# EAGLE design Car display system PCB (EAGLE 9.4.0)
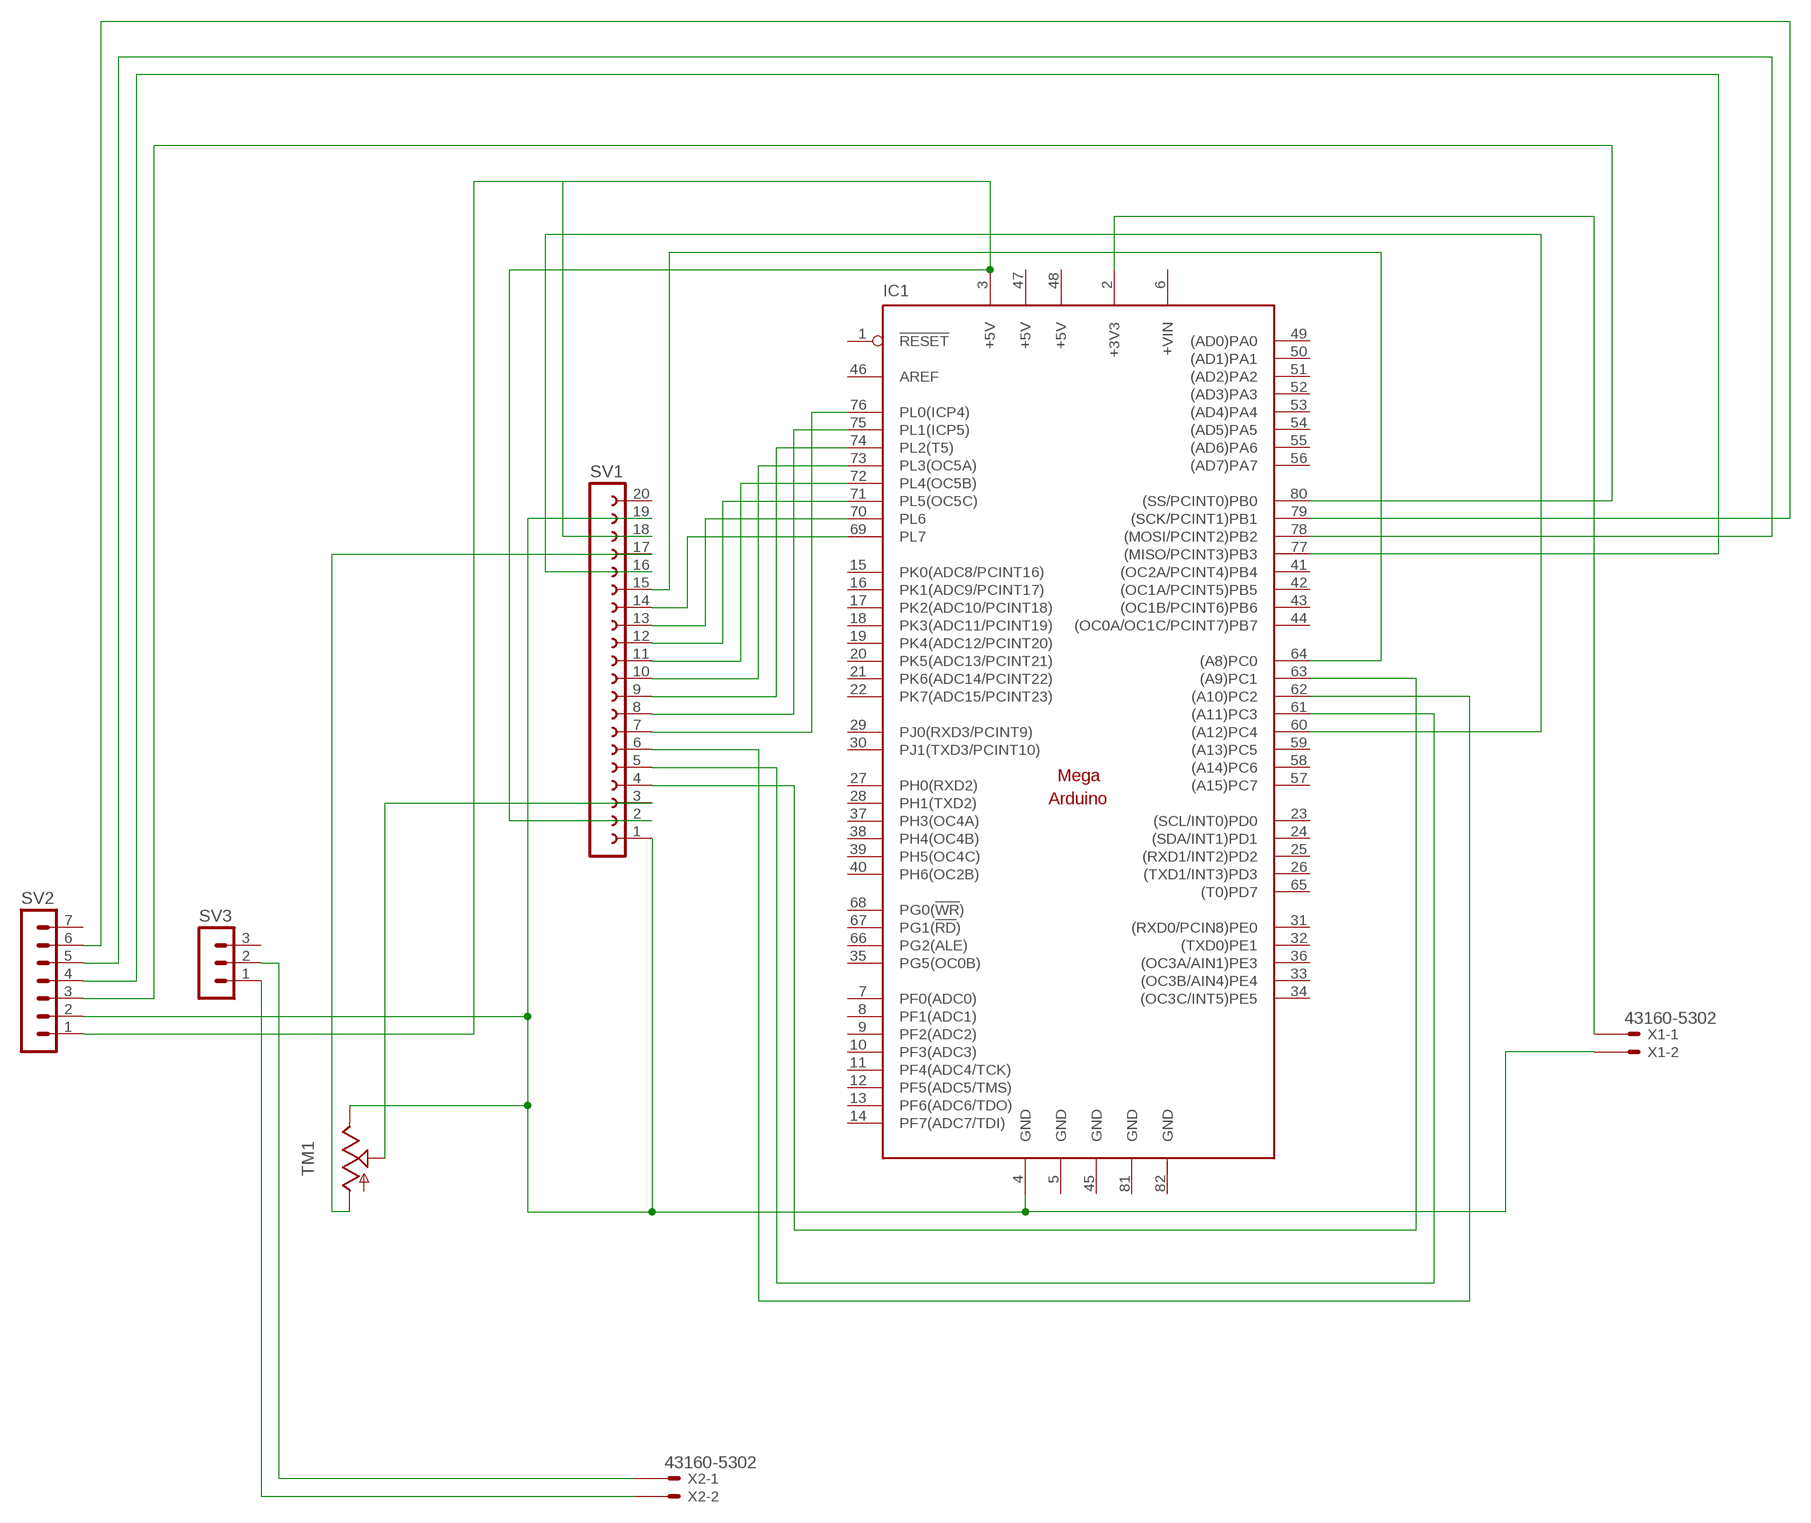
[diagram p0: schematic, sheet 1]

## Parts
IC1  MEGAARDUINO_1  [MEGA_ARDUINO]
SV1  FE20W  [FE20W]
SV2  MA07-1  [MA07-1]
SV3  MA03-1  [MA03-1]
TM1  TRIM  [6MM]
X1  43160-5302  [43160-XX02]
X2  43160-5302  [43160-XX02]

## Nets
N$1: SV1.17 TM1.A
N$2: IC1.63((A9)PC1) SV1.4
N$3: IC1.61((A11)PC3) SV1.5
N$4: IC1.62((A10)PC2) SV1.6
N$5: IC1.76(PL0(ICP4)) SV1.7
N$6: IC1.75(PL1(ICP5)) SV1.8
N$7: IC1.74(PL2(T5)) SV1.9
N$8: IC1.73(PL3(OC5A)) SV1.10
N$9: IC1.72(PL4(OC5B)) SV1.11
N$10: IC1.71(PL5(OC5C)) SV1.12
N$11: IC1.70(PL6) SV1.13
N$12: IC1.69(PL7) SV1.14
N$13: IC1.64((A8)PC0) SV1.15
N$14: IC1.60((A12)PC4) SV1.16
N$15: IC1.4(GND) SV1.1 SV1.19 SV2.2 TM1.E X1.2@1(-2:S)
N$16: IC1.3(+5V) SV1.2 SV1.18 SV2.1
N$17: IC1.80((SS/PCINT0)PB0) SV2.3
N$18: IC1.77((MISO/PCINT3)PB3) SV2.4
N$19: IC1.78((MOSI/PCINT2)PB2) SV2.5
N$20: IC1.79((SCK/PCINT1)PB1) SV2.6
N$21: SV1.3 TM1.S
N$22: SV3.1 X2.2@1(-2:S)
N$23: IC1.2(+3V3) X1.1@1(-1:S)
N$24: SV3.2 X2.1@1(-1:S)
Unconnected: IC1.1(!RESET) IC1.7(PF0(ADC0)) IC1.8(PF1(ADC1)) IC1.9(PF2(ADC2)) IC1.10(PF3(ADC3)) IC1.11(PF4(ADC4/TCK)) IC1.12(PF5(ADC5/TMS)) IC1.13(PF6(ADC6/TDO)) IC1.14(PF7(ADC7/TDI)) IC1.15(PK0(ADC8/PCINT16)) IC1.16(PK1(ADC9/PCINT17)) IC1.17(PK2(ADC10/PCINT18)) IC1.18(PK3(ADC11/PCINT19)) IC1.19(PK4(ADC12/PCINT20)) IC1.20(PK5(ADC13/PCINT21)) IC1.21(PK6(ADC14/PCINT22)) IC1.22(PK7(ADC15/PCINT23)) IC1.23((SCL/INT0)PD0) IC1.24((SDA/INT1)PD1) IC1.25((RXD1/INT2)PD2) IC1.26((TXD1/INT3)PD3) IC1.27(PH0(RXD2)) IC1.28(PH1(TXD2)) IC1.29(PJ0(RXD3/PCINT9)) IC1.30(PJ1(TXD3/PCINT10)) IC1.31((RXD0/PCIN8)PE0) IC1.32((TXD0)PE1) IC1.33((OC3B/AIN4)PE4) IC1.34((OC3C/INT5)PE5) IC1.35(PG5(OC0B)) IC1.36((OC3A/AIN1)PE3) IC1.37(PH3(OC4A)) IC1.38(PH4(OC4B)) IC1.39(PH5(OC4C)) IC1.40(PH6(OC2B)) IC1.41((OC2A/PCINT4)PB4) IC1.42((OC1A/PCINT5)PB5) IC1.43((OC1B/PCINT6)PB6) IC1.44((OC0A/OC1C/PCINT7)PB7) IC1.46(AREF) IC1.49((AD0)PA0) IC1.50((AD1)PA1) IC1.51((AD2)PA2) IC1.52((AD3)PA3) IC1.53((AD4)PA4) IC1.54((AD5)PA5) IC1.55((AD6)PA6) IC1.56((AD7)PA7) IC1.57((A15)PC7) IC1.58((A14)PC6) IC1.59((A13)PC5) IC1.65((T0)PD7) IC1.66(PG2(ALE)) IC1.67(PG1(!RD!)) IC1.68(PG0(!WR!)) SV1.20 SV2.7 SV3.3 X1.1@2(-1:S) X1.2@2(-2:S) X2.1@2(-1:S) X2.2@2(-2:S)

## Power pins joined to a net without a drawn wire
+5V: IC1.47(+5V) IC1.48(+5V)
+VIN: IC1.6(+VIN)
GND: IC1.5(GND) IC1.45(GND) IC1.81(GND) IC1.82(GND)

## Library data of the parts
IC1 = arduino:MEGAARDUINO_1: The Arduino Mega is a microcontroller board based on the ATmega1280. - 54 digital input/output pins (of which 14 can be used as PWM outputs) - 16 analog inputs - 4 UARTs (hardware serial ports) - 16 MHz crystal oscillator - USB connection - power jack - ICSP header - reset button It contains everything needed to support the microcontroller; simply connect it to a computer with a USB cable or power it with a AC-to-DC adapter or battery to get started. The Mega is compatible with most shields designed for the Arduino Duemilanove or Diecimila. http://arduino.cc/en/Main/ArduinoBoardMega
SV1 = con-lsta:FE20W: FEMALE HEADER; OC_FARNELL: unknown; OC_NEWARK: unknown
SV2 = con-lstb:MA07-1: PIN HEADER; OC_FARNELL: unknown; OC_NEWARK: unknown
SV3 = con-lstb:MA03-1: PIN HEADER; OC_FARNELL: unknown; OC_NEWARK: unknown
TM1 = adafruit:TRIM
X1 X2 = con-molex:43160-*02: SDA-43160 Connector Source: http://www.molex.com/pdm_docs/sd/431601306_sd.pdf; MF: MOLEX; MPN: 43160-5302; OC_FARNELL: unknown; OC_NEWARK: 92M1498

## Board
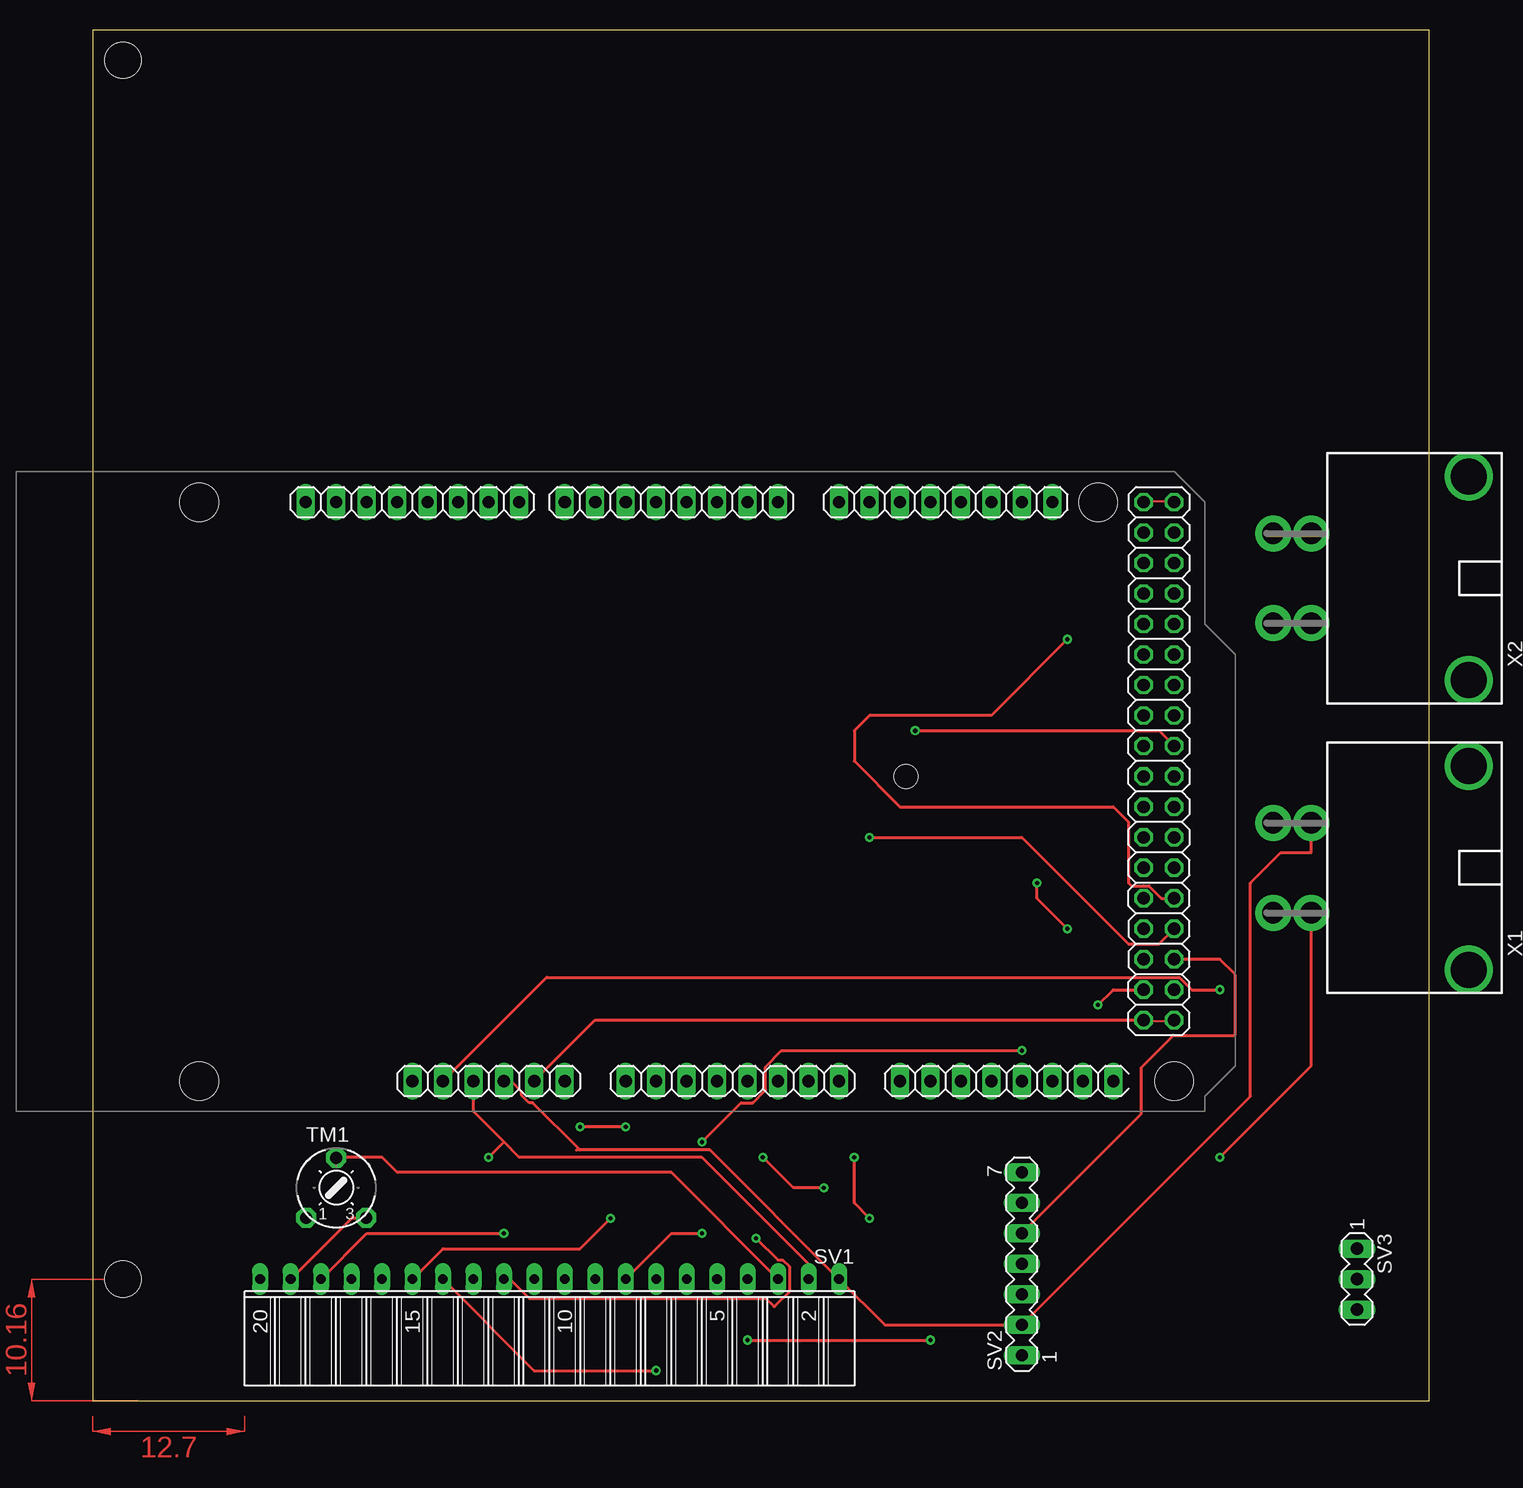
[diagram p1: board, top side]
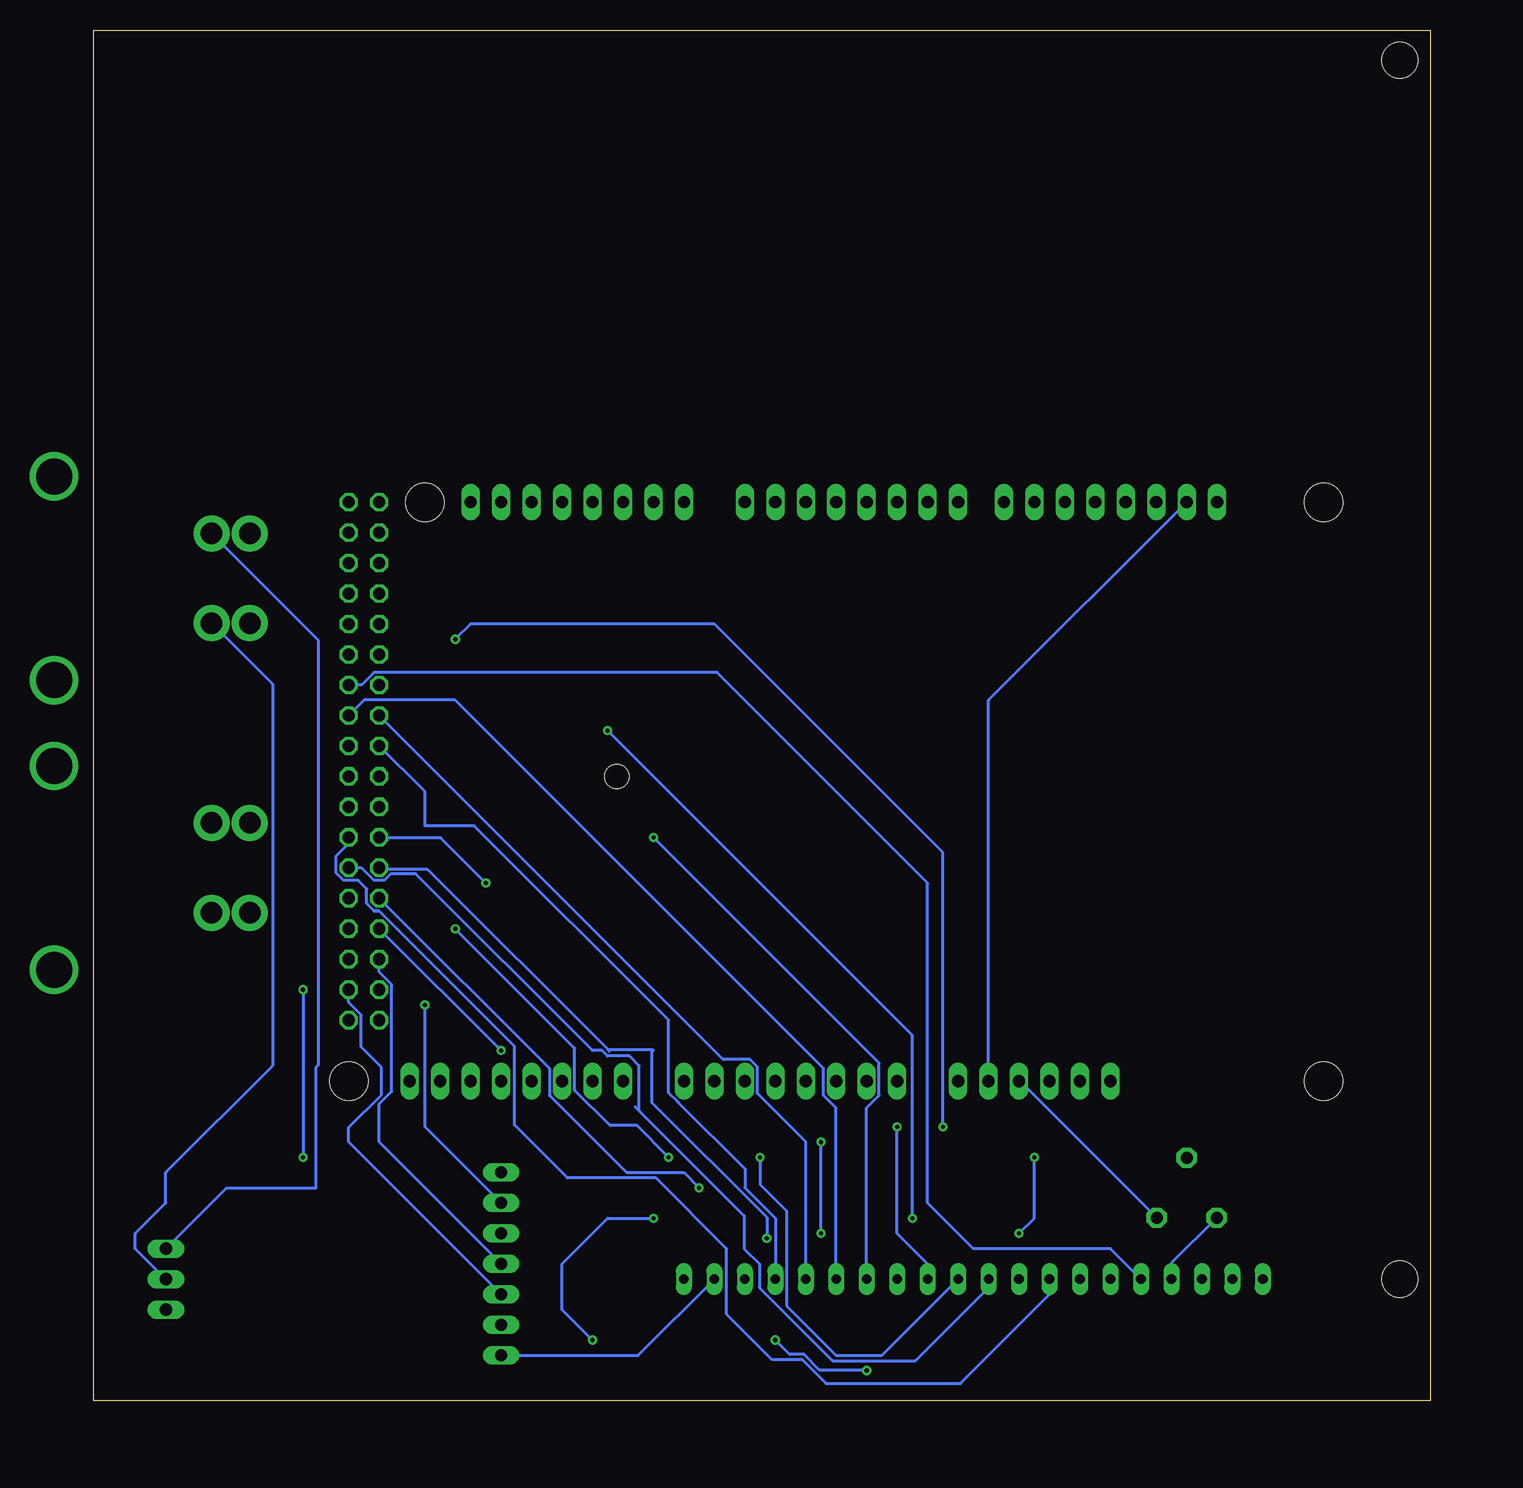
[diagram p2: board, bottom side, seen from below]

Size 111.43 x 114.29 mm. Coordinates in mm from the lower left corner, seen from the top.
Outline: 0,0 111.43,0 111.43,114.29 0,114.29 0,0
Copper layers (1*16): Top 0.035mm / dielectric 1.5mm / Bottom 0.035mm
Design rules "default": minimum track width 6mil, minimum drill 0.35mm, track to track 6mil, track to pad 6mil, pad to pad 6mil, via to via 6mil, smd to smd 6mil, copper to edge 40mil, drill to drill 6mil, minimum pad ring 10mil, minimum via ring 8mil, stop-mask expansion 4mil, vias tented up to drill 0mil, thermal gap 10mil
Holes 3 mm at 2.54,111.76 2.54,10.16

### Footprints (pad centres in the part's own frame; a part is rotated, then mirrored left to right if it is on the bottom)
MEGA_ARDUINO = drill 1.016 long: 1 33.02,2.54; 2 35.56,2.54; 3 38.1,2.54; 4 40.64,2.54; 5 43.18,2.54; 6 45.72,2.54; 7 50.8,2.54; 8 53.34,2.54; 9 55.88,2.54; 10 58.42,2.54; 11 60.96,2.54; 12 63.5,2.54; 13 66.04,2.54; 14 68.58,2.54; 15 73.66,2.54; 16 76.2,2.54; 17 78.74,2.54; 18 81.28,2.54; 19 83.82,2.54; 20 86.36,2.54; 21 88.9,2.54; 22 91.44,2.54; 23 86.36,50.8; 24 83.82,50.8; 25 81.28,50.8; 26 78.74,50.8; 27 76.2,50.8; 28 73.66,50.8; 29 71.12,50.8; 30 68.58,50.8; 31 63.5,50.8; 32 60.96,50.8; 33 58.42,50.8; 34 55.88,50.8; 35 53.34,50.8; 36 50.8,50.8; 37 48.26,50.8; 38 45.72,50.8; 39 41.91,50.8; 40 39.37,50.8; 41 36.83,50.8; 42 34.29,50.8; 43 31.75,50.8; 44 29.21,50.8; 45 26.67,50.8; 46 24.13,50.8 | drill 1.016 octagon: 47 93.98,50.8; 48 96.52,50.8; 49 93.98,48.26; 50 96.52,48.26; 51 93.98,45.72; 52 96.52,45.72; 53 93.98,43.18; 54 96.52,43.18; 55 93.98,40.64; 56 96.52,40.64; 57 93.98,38.1; 58 96.52,38.1; 59 93.98,35.56; 60 96.52,35.56; 61 93.98,33.02; 62 96.52,33.02; 63 93.98,30.48; 64 96.52,30.48; 65 93.98,27.94; 66 96.52,27.94; 67 93.98,25.4; 68 96.52,25.4; 69 93.98,22.86; 70 96.52,22.86; 71 93.98,20.32; 72 96.52,20.32; 73 93.98,17.78; 74 96.52,17.78; 75 93.98,15.24; 76 96.52,15.24; 77 93.98,12.7; 78 96.52,12.7; 79 93.98,10.16; 80 96.52,10.16; 81 93.98,7.62; 82 96.52,7.62 | hole 3.2: 15.24,50.8; 15.24,2.54; 90.17,50.8; 96.52,2.54 | hole 2: 74.168,27.94
FE20W = drill 0.813 long: 1 -24.13,0; 2 -21.59,0; 3 -19.05,0; 4 -16.51,0; 5 -13.97,0; 6 -11.43,0; 7 -8.89,0; 8 -6.35,0; 9 -3.81,0; 10 -1.27,0; 11 1.27,0; 12 3.81,0; 13 6.35,0; 14 8.89,0; 15 11.43,0; 16 13.97,0; 17 16.51,0; 18 19.05,0; 19 21.59,0; 20 24.13,0
MA07-1 = drill 1.016 long: 1 -7.62,0; 2 -5.08,0; 3 -2.54,0; 4 0,0; 5 2.54,0; 6 5.08,0; 7 7.62,0
MA03-1 = drill 1.016 long: 1 -2.54,0; 2 0,0; 3 2.54,0
6MM = drill 1 pad 1.676 octagon: A -2.5,-2.5; E 2.5,-2.5; S 0,2.5
43160-XX02 = drill 1.8 pad 3: 1@1 -3.745,0; 1@2 -3.745,3.18; 2@1 3.745,0; 2@2 3.745,3.18 | drill 3 pad 3.4: M1 -8.495,-13.13; M2 8.495,-13.13

### Placement (x,y rotation side)
IC1  -6.35,24.13 0 top
SV1  38.1,10.16 180 top
SV2  77.47,11.43 90 top
SV3  105.41,10.16 270 top
TM1  20.32,17.78 0 top
X1  101.6,44.45 90 top
X2  101.6,68.58 90 top

### Tracks (layer width: path | path; a pad name or v marks a point on that pad's centre or on a via)
+5V
  Top 0.152: IC1.47 87.63,74.98 90.07,74.98 IC1.48
GND
  Top 0.152: IC1.82 90.07,31.7 87.63,31.7 IC1.81
  Top 0.254: IC1.5 41.91,31.75 IC1.81
  Bottom 0.254: IC1.5 36.83,58.42 IC1.45
N$1
  Bottom 0.254: TM1.A 21.59,11.51 SV1.17
N$2
  Bottom 0.254: IC1.63 83.82,50.8 83.82,47.95 79.71,47.95 63.5,31.75 63.5,25.7 62.71,24.92 62.66,24.87 57.15,19.36 57.15,17.78 54.61,15.24 SV1.4
N$3
  Bottom 0.254: SV1.5 52.07,21.59 56.11,25.63 56.11,27.86 56.72,28.47 58.95,28.47 IC1.61
N$4
  Bottom 0.254: SV1.6 49.53,24.43 50.57,25.48 50.57,27.71 81.28,58.42 88.9,58.42 IC1.62
N$5  (via drill 0.35)
  Top 0.254: v64.77,46.99 77.47,46.99 86.36,38.1 88.9,38.1 IC1.76
  Bottom 0.254: SV1.7 46.99,24.43 45.95,25.48 45.95,28.17 v64.77,46.99
N$6  (via drill 0.35)
  Top 0.254: SV1.8 48.26,13.97 v50.8,13.97 | v50.8,21.59 54.08,24.87 55.04,24.87 56.11,25.93 56.11,27.86 57.45,29.21 v77.47,29.21
  Bottom 0.254: v50.8,13.97 v50.8,21.59 | v77.47,29.21 IC1.75
N$7  (via drill 0.35)
  Top 0.254: v44.45,22.86 v40.64,22.86 | v81.28,63.5 74.93,57.15 64.77,57.15 63.5,55.88 63.5,53.34 67.31,49.53 85.09,49.53 86.36,48.26 86.36,43.18 86.59,42.95 87.63,42.95 88.06,42.95 89.1,41.91 IC1.74
  Bottom 0.254: SV1.9 41.91,11.43 44.45,13.97 v44.45,22.86 | v40.64,22.86 40.64,45.72 59.69,64.77 80.01,64.77 v81.28,63.5
N$8  (via drill 0.35)
  Top 0.254: v60.96,17.78 58.42,17.78 v55.88,20.32
  Bottom 0.254: IC1.73 73.43,27.71 73.43,25.48 67,19.05 62.23,19.05 v60.96,17.78 | v55.88,20.32 55.88,18.05 53.67,15.84 53.67,7.95 49.53,3.81 45.72,3.81 SV1.10
N$9
  Bottom 0.254: SV1.11 36.83,9.45 42.93,3.35 49.84,3.35 55.93,9.45 55.93,11.43 57.2,12.7 57.2,15.44 65.96,24.21 | 66.29,24.54 65.96,24.21 | 65.96,24.21 65.96,27.94 66.78,28.75 68.6,28.75 69.05,29.21 69.85,29.21 84.58,43.94 86.66,43.94 87.2,43.41 88.06,43.41 89.1,44.45 IC1.72
N$10  (via drill 0.35)
  Top 0.152: 34.9,10.06 34.29,10.06 SV1.12
  Top 0.254: 34.9,10.06 36.42,8.53 56.13,8.53 56.79,7.87 56.85,7.87 58.09,9.11 58.09,11.21 57.54,11.76 57.12,11.76 v55.32,13.56
  Bottom 0.254: v55.32,13.56 55.32,15.29 64.87,24.84 64.87,29.11 64.77,29.21 64.82,29.26 68.53,29.26 | 68.53,29.26 83.62,44.35 87.63,44.35 IC1.71 | 68.53,29.26 68.43,29.16
N$11
  Bottom 0.254: SV1.13 31.75,8.89 39.17,1.47 50.39,1.47 52.4,3.48 54.94,3.48 58.67,7.21 58.67,12.7 64.57,18.59 71.93,18.59 76.35,23.01 76.35,29.57 87.63,40.84 | 88.09,40.84 87.63,40.84 | IC1.70 90.17,46.5 91.21,45.46 91.21,44.02 90.6,43.41 89.38,43.41 88.67,42.7 88.67,41.48 88.06,40.87 87.66,40.87 87.63,40.84
N$12  (via drill 0.35)
  Top 0.254: SV1.14 36.83,2.54 v46.99,2.54 | v54.61,5.08 v69.85,5.08 | v64.77,15.24 63.5,16.51 v63.5,20.32 | v81.28,39.37 78.74,41.91 v78.74,43.18
  Bottom 0.152: 49.51,2.56 49.48,2.54 | 87.63,46.94 IC1.69
  Bottom 0.254: v46.99,2.54 47.02,2.56 49.51,2.56 50.91,2.56 52.23,3.89 53.42,3.89 v54.61,5.08 | v69.85,5.08 72.39,7.62 72.39,11.43 68.58,15.24 v64.77,15.24 | v63.5,20.32 66.14,22.96 68.38,22.96 71.32,25.91 71.32,29.41 v81.28,39.37 | v78.74,43.18 82.5,46.94 87.63,46.94
N$13  (via drill 0.35)
  Top 0.254: SV1.15 29.21,12.7 40.64,12.7 v43.18,15.24 | v68.58,55.88 88.9,55.88 IC1.64
  Bottom 0.254: v43.18,15.24 43.18,30.48 v68.58,55.88
N$14
  Bottom 0.254: SV1.16 26.67,12.7 38.1,12.7 41.91,16.51 41.91,43.18 59.46,60.73 88.06,60.73 89.1,59.69 IC1.60
N$15
  Top 0.254: X1.2@1 101.6,45.72 99.06,45.72 96.52,43.18 96.52,25.4 SV2.2 66.04,6.35 SV1.1 51.46,20.93 40.64,20.93 | SV1.19 21.63,15.28 TM1.E | 40.64,20.93 40.33,20.93 | IC1.4 34.9,26.67 35.79,25.78 35.79,25.48 36.4,24.87 36.71,24.87 40.64,20.93
  Bottom 0.254: TM1.E 34.21,26.67 IC1.4
N$16  (via drill 0.35)
  Top 0.254: SV1.2 59.69,11.43 50.8,20.32 35.56,20.32 34.29,21.59 | 34.29,21.59 31.75,24.13 IC1.3 | SV1.18 22.86,13.97 v34.29,13.97 | v33.02,20.32 34.29,21.59
  Bottom 0.254: v34.29,13.97 33.02,15.24 v33.02,20.32 | SV2.1 66.04,3.81 SV1.2
N$17
  Bottom 0.254: SV2.3 90.17,21.59 90.17,22.79 87.43,25.53 87.43,27.81 89.13,29.51 89.13,32.18 90.17,33.22 IC1.80
N$18
  Bottom 0.254: SV2.4 87.63,21.59 87.63,24.76 86.59,25.8 86.59,34.72 87.63,35.76 IC1.77
N$19
  Top 0.254: SV2.5 87.43,23.93 87.43,27.81 90.1,30.48 95.25,30.48 95.25,35.56 93.98,36.83 IC1.78
N$20  (via drill 0.35)
  Top 0.254: v83.82,33.02 85.09,34.29 IC1.79
  Bottom 0.254: SV2.6 83.82,22.86 v83.82,33.02
N$21
  Top 0.254: SV1.3 48.26,19.05 25.4,19.05 24.13,20.32 20.36,20.32 TM1.S
N$22
  Bottom 0.254: X2.2@1 92.71,63.44 92.71,28.01 92.91,27.81 92.91,17.76 100.35,17.76 SV3.1
N$23  (via drill 0.35)
  Top 0.254: v93.98,34.29 91.64,34.29 90.6,35.33 37.87,35.33 IC1.2 | v93.98,20.32 101.6,27.94 X1.1@1
  Bottom 0.254: v93.98,34.29 v93.98,20.32
N$24
  Bottom 0.254: X2.1@1 96.52,59.76 96.52,27.94 105.41,19.05 105.41,16.51 107.95,13.97 107.95,12.7 SV3.2
(copper drawn outside any net)
  shapes: Top area x4